# Altium schematic sheet Sheet1.SchDoc
size 287 x 165 mm
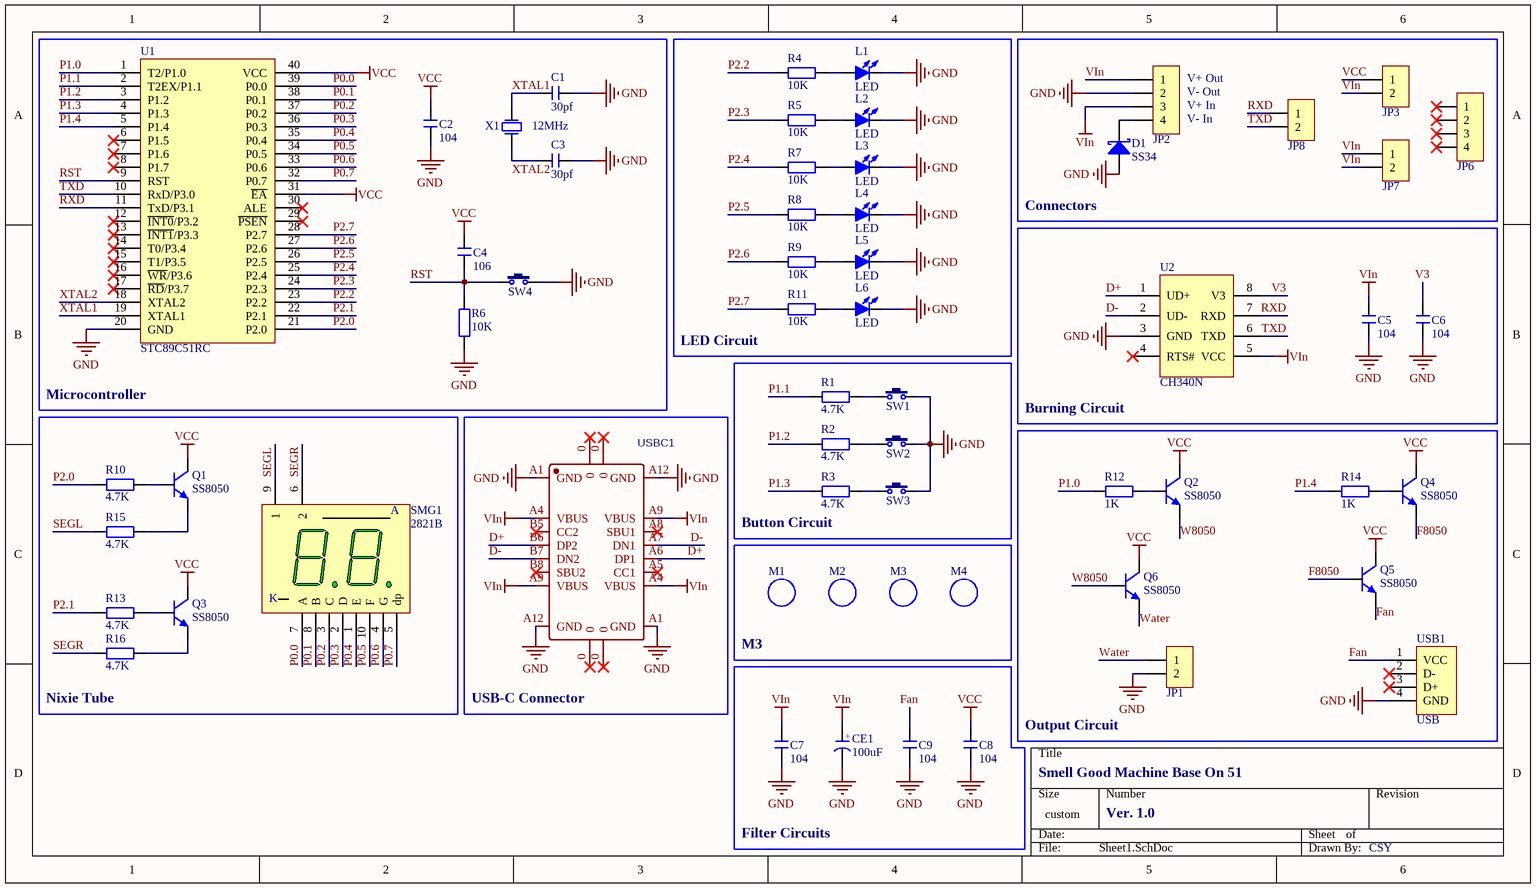
[diagram p0: Sheet1.SchDoc]

## Parts
C1  30pf  [C 0805_M]
C2  104  [C 0805_M]
C3  30pf  [C 0805_M]
C4  106  [C 0805_M]
C5  104  [C 0805_M]
C6  104  [C 0805_M]
C7  104  [C 0805_M]
C8  104  [C 0805_M]
C9  104  [C 0805_M]
CE1  100uF  [CM D(6.3*7.7)]
D1  SS34  [SMA]
JP1  HDR-1X2  [HDR2.54-LI-2P]  (value not drawn)
JP2  HDR-1X4  [HDR2.54-LI-4P]  (value not drawn)
JP3  HDR-1X2  [HDR2.54-LI-2P]  (value not drawn)
JP6  HDR-1X4  [HDR2.54-LI-4P]  (value not drawn)
JP7  HDR-1X2  [HDR2.54-LI-2P]  (value not drawn)
JP8  HDR-1X2  [HDR2.54-LI-2P]  (value not drawn)
L1  LED  [LED 0805B]
L2  LED  [LED 0805R]
L3  LED  [LED 0805R]
L4  LED  [LED 0805R]
L5  LED  [LED 0805R]
L6  LED  [LED 0805G]
M1  M3  [M3x20_N]  (value not drawn)
M2  M3  [M3x20_N]  (value not drawn)
M3  M3  [M3x20_N]  (value not drawn)
M4  M3  [M3x20_N]  (value not drawn)
Q1  SS8050  [SOT23-3M]
Q2  SS8050  [SOT23-3M]
Q3  SS8050  [SOT23-3M]
Q4  SS8050  [SOT23-3M]
Q5  SS8050  [SOT23-3M]
Q6  SS8050  [SOT23-3M]
R1  4.7K  [R 0805_M]
R2  4.7K  [R 0805_M]
R3  4.7K  [R 0805_M]
R4  10K  [R 0805_M]
R5  10K  [R 0805_M]
R6  10K  [R 0805_M]
R7  10K  [R 0805_M]
R8  10K  [R 0805_M]
R9  10K  [R 0805_M]
R10  4.7K  [R 0805_M]
R11  10K  [R 0805_M]
R12  1K  [R 0805_M]
R13  4.7K  [R 0805_M]
R14  1K  [R 0805_M]
R15  4.7K  [R 0805_M]
R16  4.7K  [R 0805_M]
SMG1  2821B  [SMG 0.28-2P]
SW1  3x6x5  [TSW SMD-3*6*2.5]  (value not drawn)
SW2  3x6x5  [TSW SMD-3*6*2.5]  (value not drawn)
SW3  3x6x5  [TSW SMD-3*6*2.5]  (value not drawn)
SW4  3x6x5  [TSW SMD-3*6*2.5]  (value not drawn)
U1  STC89C51RC  [DIP40-600_MH]
U2  CH340N  [SOP8_M]
USB1  USB  [USB-A/S_D]
USBC1  TYPE-C-31-M-12  [USB-TYPE-C-R]  (value not drawn)
X1  12MHz  [OSC HC-49SMD]

## Blocks framed on the sheet
Microcontroller: C1-C4 R6 SW4 U1 X1
LED Circuit: L1-L6 R4 R5 R7-R9 R11
Connectors: D1 JP2 JP3 JP6-JP8
Burning Circuit: C5 C6 U2
Button Circuit: R1-R3 SW1-SW3
USB-C Connector: USBC1
Output Circuit: JP1 Q2 Q4-Q6 R12 R14 USB1

## Nets
GND: C1.2 C2.1 C3.2 C5.1 C6.1 C7.1 C8.1 C9.1 CE1.2(K) D1.1(A) JP1.2 JP2.2 L1.2(K) L2.2(K) L3.2(K) L4.2(K) L5.2(K) L6.2(K) R6.1 SW1.2 SW2.2 SW3.2 SW4.2 U1.20(GND) U2.3(GND) USB1.4(GND) USBC1.A1(GND) USBC1.A12(GND)
VCC: C2.2 C4.2 C8.2 JP3.1 Q1.3(C) Q2.3(C) Q3.3(C) Q4.3(C) Q5.3(C) Q6.3(C) U1.31(~{EA}) U1.40(VCC)
VIn: C5.2 C7.2 CE1.1(A) JP2.1 JP2.3 JP3.2 JP7.1 JP7.2 U2.5(VCC) USBC1.A4(VBUS) USBC1.A9(VBUS)
D+: U2.1(UD+) USBC1.A6(DP1) USBC1.B6(DP2)
D-: U2.2(UD-) USBC1.A7(DN1) USBC1.B7(DN2)
F8050: Q4.2(E) Q5.1(B)
Fan: C9.2 Q5.2(E) USB1.1(VCC)
P0.0: SMG1.7(A) U1.39(P0.0)
P0.1: SMG1.8(B) U1.38(P0.1)
P0.2: SMG1.3(C) U1.37(P0.2)
P0.3: SMG1.2(D) U1.36(P0.3)
P0.4: SMG1.1(E) U1.35(P0.4)
P0.5: SMG1.10(F) U1.34(P0.5)
P0.6: SMG1.4(G) U1.33(P0.6)
P0.7: SMG1.5(dp) U1.32(P0.7)
P1.0: R12.2 U1.1(T2/P1.0)
P1.1: R1.2 U1.2(T2EX/P1.1)
P1.2: R2.2 U1.3(P1.2)
P1.3: R3.2 U1.4(P1.3)
P1.4: R14.2 U1.5(P1.4)
P2.0: R10.2 U1.21(P2.0)
P2.1: R13.2 U1.22(P2.1)
P2.2: R4.2 U1.23(P2.2)
P2.3: R5.2 U1.24(P2.3)
P2.4: R7.2 U1.25(P2.4)
P2.5: R8.2 U1.26(P2.5)
P2.6: R9.2 U1.27(P2.6)
P2.7: R11.2 U1.28(P2.7)
RST: C4.1 R6.2 SW4.1 U1.9(RST)
RXD: JP8.1 U1.11(TxD/P3.1) U2.7(RXD)
SEGL: R15.2 SMG1.9(1)
SEGR: R16.2 SMG1.6(2)
TXD: JP8.2 U1.10(RxD/P3.0) U2.6(TXD)
V3: C6.2 U2.8(V3)
W8050: Q2.2(E) Q6.1(B)
Water: JP1.1 Q6.2(E)
XTAL1: C1.1 U1.19(XTAL1) X1.2
XTAL2: C3.1 U1.18(XTAL2) X1.1
NetD1_2: D1.2(K) JP2.4
NetL1_1: L1.1(A) R4.1
NetL2_1: L2.1(A) R5.1
NetL3_1: L3.1(A) R7.1
NetL4_1: L4.1(A) R8.1
NetL5_1: L5.1(A) R9.1
NetL6_1: L6.1(A) R11.1
NetQ1_1: Q1.1(B) R10.1
NetQ1_2: Q1.2(E) R15.1
NetQ2_1: Q2.1(B) R12.1
NetQ3_1: Q3.1(B) R13.1
NetQ3_2: Q3.2(E) R16.1
NetQ4_1: Q4.1(B) R14.1
NetR1_1: R1.1 SW1.1
NetR2_1: R2.1 SW2.1
NetR3_1: R3.1 SW3.1

Not connected (* = marked no-connect by the designer): JP6 1* 2* 3* 4*; U1 6(P1.5)* 7(P1.6)* 8(P1.7)* 12(~{INT0}/P3.2)* 13(~{INT1}/P3.3)* 14(T0/P3.4)* 15(T1/P3.5)* 16(~{WR}/P3.6)* 17(~{RD}/P3.7)* 29(~{PSEN})* 30(ALE)*; U2 4(RTS#)*; USB1 2(D-)* 3(D+)*; USBC1 0* A5(CC1)* A8(SBU1)* B5(CC2)* B8(SBU2)*

## Notes on the sheet
- (near JP2) V+ Out
- (near JP2) V- Out
- (near JP2) V+ In
- (near JP2) V- In
- (near R16) Nixie Tube
- M3
- Smell Good Machine Base On 51
- Filter Circuits
- Ver. 1.0
- CSY
- (in symbol 2821B) K
- (in symbol CE_SMD) +

## Library data of the parts
C1-C9 = C: 贴片电容; 淘宝ID: 小糖豆的小窝窝; BOM名称: 贴片电容; 下单链接: https://item.taobao.com/item.htm?ft=t&id=613637044352
CE1 = CE_SMD: 贴片电解电容; 淘宝ID: 小糖豆的小窝窝; BOM名称: 贴片电解电容; 下单链接: https://item.taobao.com/item.htm?ft=t&id=613637044352
D1 = SS34: 肖特基二极管; 淘宝ID: 小糖豆的小窝窝; BOM名称: 肖特基二极管; 下单链接: https://item.taobao.com/item.htm?ft=t&id=613637044352
JP1 JP3 JP7 JP8 = Header 2: 2P接插件; 淘宝ID: 小糖豆的小窝窝; BOM名称: 2P接插件; 下单链接: https://item.taobao.com/item.htm?ft=t&id=613637044352
JP2 JP6 = Header 4: 4P接插件; 淘宝ID: 小糖豆的小窝窝; BOM名称: 4P接插件; 下单链接: https://item.taobao.com/item.htm?ft=t&id=613637044352
L1-L6 = LED: 发光二极管; 淘宝ID: 小糖豆的小窝窝; BOM名称: 发光二极管; 下单链接: https://item.taobao.com/item.htm?ft=t&id=613637044352
M1-M4 = M3: 铜柱孔; 淘宝ID: 小糖豆的小窝窝; BOM名称: 铜柱孔; 下单链接: https://item.taobao.com/item.htm?ft=t&id=613637044352
Q1-Q6 = 8050-SMD: 高频放大-NPN型; 淘宝ID: 小糖豆的小窝窝; BOM名称: 高频放大-NPN型; 下单链接: https://item.taobao.com/item.htm?ft=t&id=613637044352
R1-R16 = R: 贴片电阻; 淘宝ID: 小糖豆的小窝窝; BOM名称: 贴片电阻; 下单链接: https://item.taobao.com/item.htm?ft=t&id=613637044352
SMG1 = 2821B: 0.28寸2位共阳数码管; 淘宝ID: 小糖豆的小窝窝; BOM名称: 0.28寸2位共阳数码管; 下单链接: https://item.taobao.com/item.htm?ft=t&id=613637044352
SW1-SW4 = TSW 3x6: 3x6轻触开关; 淘宝ID: 小糖豆的小窝窝; BOM名称: 3x6轻触开关; 下单链接: https://item.taobao.com/item.htm?ft=t&id=613637044352
U1 = STC89C51RC: STC单片机; 淘宝ID: 小糖豆的小窝窝; BOM名称: STC单片机; Alias1: https://item.taobao.com/item.htm?ft=t&id=613637044352
U2 = CH340N: CH340N/CH330N
USB1 = USB-A/S: USB-A型母接口; 淘宝ID: 小糖豆的小窝窝; BOM名称: USB-A型母接口; 下单链接: https://item.taobao.com/item.htm?ft=t&id=613637044352
USBC1 = TYPE-C-31-M-12: Type-C母座; BOM_Manufacturer: Rectangular Connectors - Contacts; Contributor: LCSC; BOM_Supplier: LCSC; BOM_Supplier Part: C165948; BOM_Manufacturer Part: TYPE-C-31-M-12; spicePre: U; spiceSymbolName: TYPE-C-31-M-12
X1 = XTAL-2P: 2脚无源脚晶振; 淘宝ID: 小糖豆的小窝窝; BOM名称: 2脚无源脚晶振; 下单链接: https://item.taobao.com/item.htm?ft=t&id=613637044352